# Altium schematic sheet Topsheet_SPECTRE3.0.SchDoc
size A4
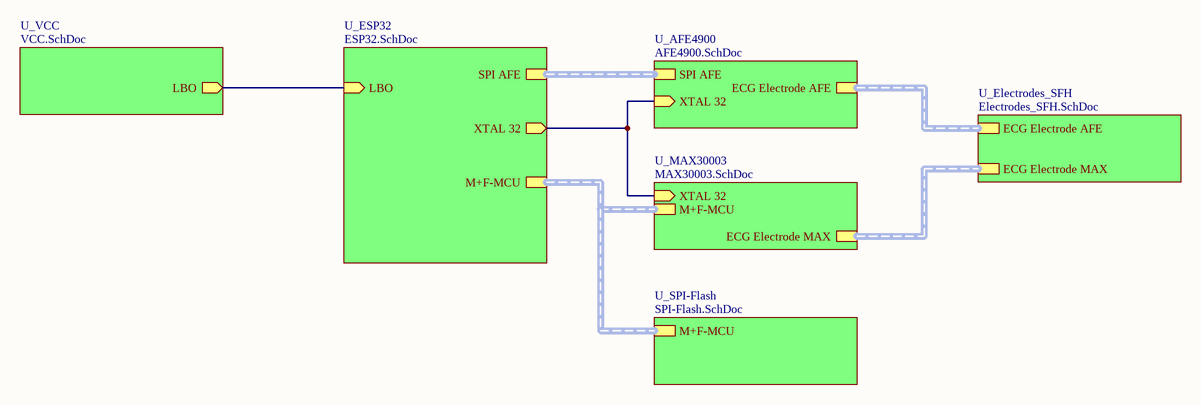
[diagram p0: Topsheet_SPECTRE3.0.SchDoc]

## Sub-sheets
U_AFE4900 = AFE4900.SchDoc: XTAL 32 (in), ECG Electrode AFE (harness ECG Electrode AFE), SPI AFE (harness SPI AFE)
U_Electrodes_SFH = Electrodes_SFH.SchDoc: ECG Electrode AFE (harness ECG Electrode AFE), ECG Electrode MAX (harness ECG Electrode MAX)
U_ESP32 = ESP32.SchDoc: XTAL 32 (out), M+F-MCU (harness M+F-MCU), SPI AFE (harness SPI AFE), LBO (in)
U_MAX30003 = MAX30003.SchDoc: ECG Electrode MAX (harness ECG Electrode MAX), XTAL 32 (in), M+F-MCU (harness M+F-MCU)
U_SPI-Flash = SPI-Flash.SchDoc: M+F-MCU (harness M+F-MCU)
U_VCC = VCC.SchDoc: LBO (out)

## Nets
(unnamed): sheet U_VCC/LBO, sheet U_ESP32/LBO
(unnamed): sheet U_ESP32/XTAL 32, sheet U_MAX30003/XTAL 32, sheet U_AFE4900/XTAL 32

## Buses and harness runs
harness sheet U_AFE4900/ECG Electrode AFE = sheet U_Electrodes_SFH/ECG Electrode AFE
harness sheet U_AFE4900/SPI AFE = sheet U_ESP32/SPI AFE
harness sheet U_Electrodes_SFH/ECG Electrode MAX = sheet U_MAX30003/ECG Electrode MAX
harness sheet U_ESP32/M+F-MCU = sheet U_MAX30003/M+F-MCU = sheet U_SPI-Flash/M+F-MCU